# Altium project Unnamed_PCB.PrjPcb
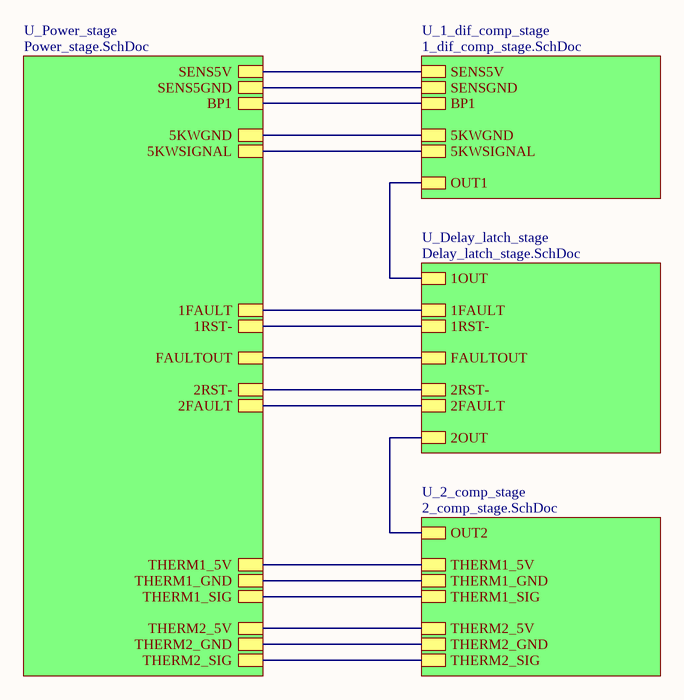
[diagram p0: Port_Connections.SchDoc]
5 sheets, 161 parts. Net scope: hierarchical (ports join the sheet entries above them; power ports are global).
Board file: PCB.PcbDoc
Sheets:
  Port_Connections.SchDoc
    U_2_comp_stage = 2_comp_stage.SchDoc
    U_Power_stage = Power_stage.SchDoc
    U_Delay_latch_stage = Delay_latch_stage.SchDoc
    U_1_dif_comp_stage = 1_dif_comp_stage.SchDoc

## Sheet Port_Connections.SchDoc
size A4; SheetNumber: 1; SheetTotal: 4

### Sub-sheets
U_1_dif_comp_stage = 1_dif_comp_stage.SchDoc: SENS5V, SENSGND, 5KWGND, BP1, 5KWSIGNAL, OUT1
U_2_comp_stage = 2_comp_stage.SchDoc: THERM2_5V, THERM2_GND, THERM2_SIG, THERM1_SIG, THERM1_GND, THERM1_5V, OUT2
U_Delay_latch_stage = Delay_latch_stage.SchDoc: FAULTOUT, 2FAULT, 1FAULT, 1OUT, 2OUT, 1RST-, 2RST-
U_Power_stage = Power_stage.SchDoc: SENS5V, SENS5GND, BP1, 5KWSIGNAL, 5KWGND, FAULTOUT, 1RST-, 1FAULT, 2FAULT, THERM1_5V, THERM1_GND, THERM1_SIG, THERM2_5V, THERM2_GND, THERM2_SIG, 2RST-

### Nets
1FAULT: sheet U_Power_stage/1FAULT, sheet U_Delay_latch_stage/1FAULT
1RST-: sheet U_Power_stage/1RST-, sheet U_Delay_latch_stage/1RST-
2FAULT: sheet U_Power_stage/2FAULT, sheet U_Delay_latch_stage/2FAULT
2RST-: sheet U_Power_stage/2RST-, sheet U_Delay_latch_stage/2RST-
5KWGND: sheet U_Power_stage/5KWGND, sheet U_1_dif_comp_stage/5KWGND
5KWSIGNAL: sheet U_Power_stage/5KWSIGNAL, sheet U_1_dif_comp_stage/5KWSIGNAL
BP1: sheet U_Power_stage/BP1, sheet U_1_dif_comp_stage/BP1
SENS5V: sheet U_Power_stage/SENS5V, sheet U_1_dif_comp_stage/SENS5V
SENSGND: sheet U_Power_stage/SENS5GND, sheet U_1_dif_comp_stage/SENSGND
THERM1_5V: sheet U_2_comp_stage/THERM1_5V, sheet U_Power_stage/THERM1_5V
THERM1_GND: sheet U_2_comp_stage/THERM1_GND, sheet U_Power_stage/THERM1_GND
THERM1_SIG: sheet U_2_comp_stage/THERM1_SIG, sheet U_Power_stage/THERM1_SIG
THERM2_5V: sheet U_2_comp_stage/THERM2_5V, sheet U_Power_stage/THERM2_5V
THERM2_GND: sheet U_2_comp_stage/THERM2_GND, sheet U_Power_stage/THERM2_GND
THERM2_SIG: sheet U_2_comp_stage/THERM2_SIG, sheet U_Power_stage/THERM2_SIG
NetD91_2: sheet U_Delay_latch_stage/1OUT, sheet U_1_dif_comp_stage/OUT1
NetD93_2: sheet U_2_comp_stage/OUT2, sheet U_Delay_latch_stage/2OUT
NetR112_2: sheet U_Power_stage/FAULTOUT, sheet U_Delay_latch_stage/FAULTOUT

## Sheet 2_comp_stage.SchDoc
size A4; SheetNumber: 3; SheetTotal: 6
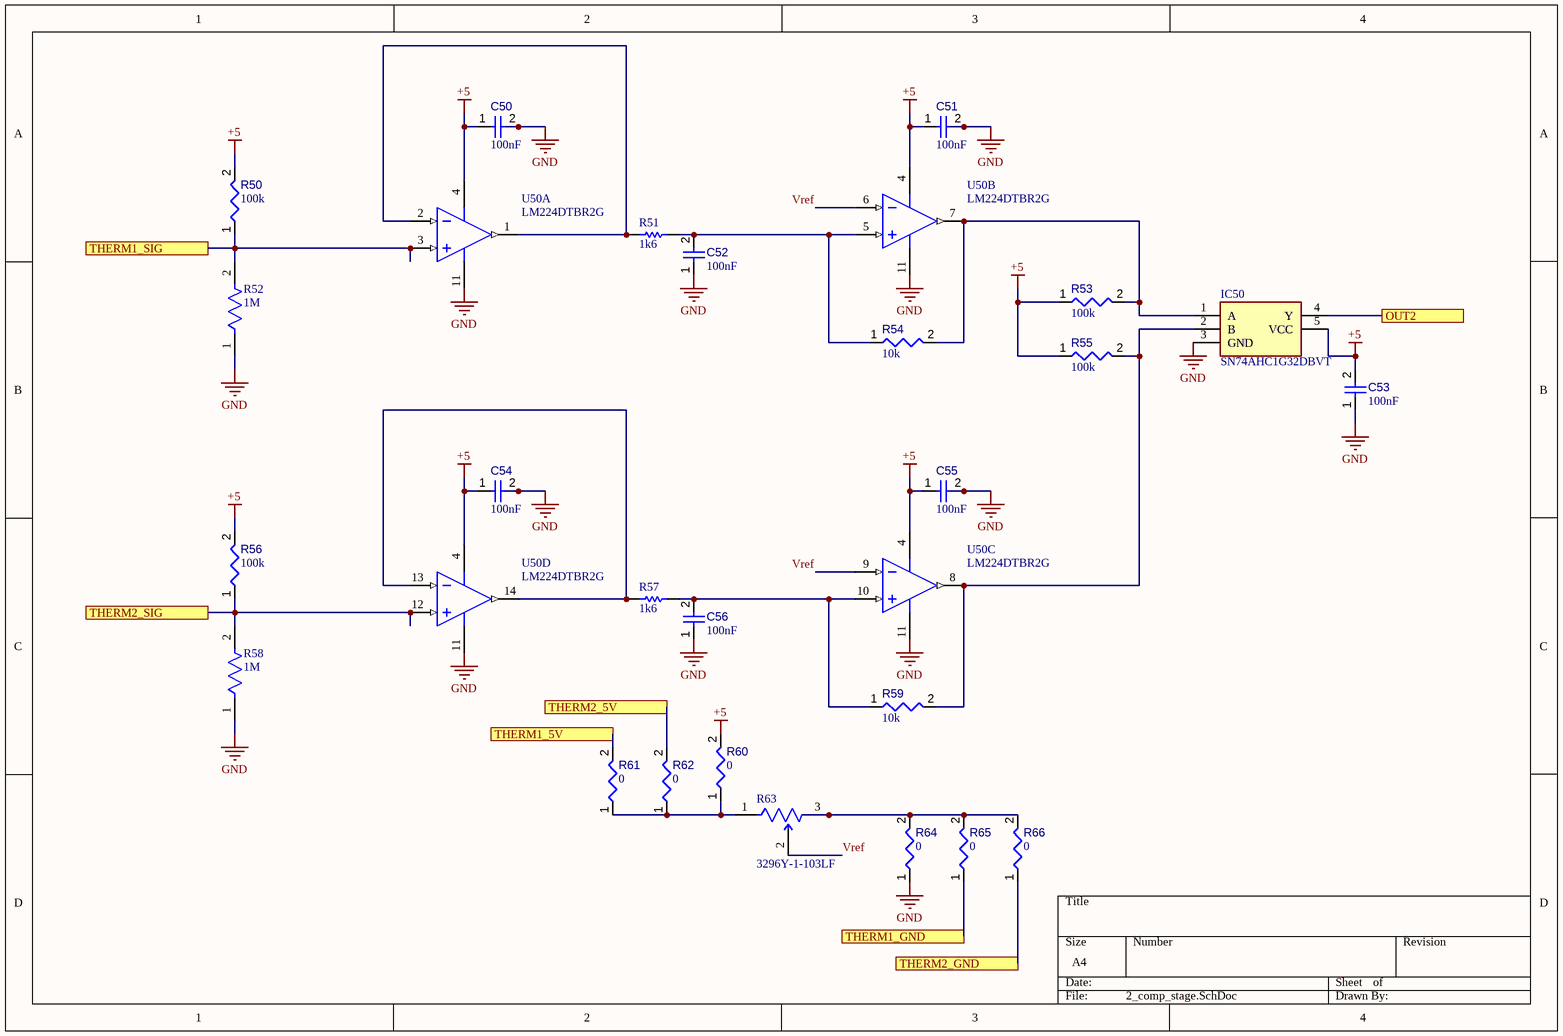
[diagram p1: 2_comp_stage.SchDoc]

### Parts
C50  value 100nF  [CAPC1608X90X40NL10T20]  (hidden comment: Capacitor 100 nF +/-10% 50 V 0603)
C51  value 100nF  [CAPC1608X90X40NL10T20]  (hidden comment: Capacitor 100 nF +/-10% 50 V 0603)
C52  value 100nF  [CAPC1608X90X40NL10T20]  (hidden comment: Capacitor 100 nF +/-10% 50 V 0603)
C53  value 100nF  [CAPC1608X90X40NL10T20]  (hidden comment: Capacitor 100 nF +/-10% 50 V 0603)
C54  value 100nF  [CAPC1608X90X40NL10T20]  (hidden comment: Capacitor 100 nF +/-10% 50 V 0603)
C55  value 100nF  [CAPC1608X90X40NL10T20]  (hidden comment: Capacitor 100 nF +/-10% 50 V 0603)
C56  value 100nF  [CAPC1608X90X40NL10T20]  (hidden comment: Capacitor 100 nF +/-10% 50 V 0603)
IC50  SN74AHC1G32DBVT  [SOT95P280X145-5N]
R50  value 100k  [RESC1608X55X25ML10T15]  (hidden comment: Resistor 100k +/-1% 0603 100 mW)
R51  1k6  [RESC1609X50X30LL10T20]
R52  1M  [FP-RMCF0603-IPC_B]
R53  value 100k  [RESC1608X55X25ML10T15]  (hidden comment: Resistor 100k +/-1% 0603 100 mW)
R54  value 10k  [RESC1608X55X25ML10T15]  (hidden comment: Resistor 10k +/-1% 0603 100 mW)
R55  value 100k  [RESC1608X55X25ML10T15]  (hidden comment: Resistor 100k +/-1% 0603 100 mW)
R56  value 100k  [RESC1608X55X25ML10T15]  (hidden comment: Resistor 100k +/-1% 0603 100 mW)
R57  1k6  [RESC1609X50X30LL10T20]
R58  1M  [FP-RMCF0603-IPC_B]
R59  value 10k  [RESC1608X55X25ML10T15]  (hidden comment: Resistor 10k +/-1% 0603 100 mW)
R60  value 0  [RESC0603(1608)_L]  (hidden comment: 0R3J)
R61  value 0  [RESC0603(1608)_L]  (hidden comment: 0R3J)
R62  value 0  [RESC0603(1608)_L]  (hidden comment: 0R3J)
R63  3296Y-1-103LF  [FP-3296Y-MFG]
R64  value 0  [RESC0603(1608)_L]  (hidden comment: 0R3J)
R65  value 0  [RESC0603(1608)_L]  (hidden comment: 0R3J)
R66  value 0  [RESC0603(1608)_L]  (hidden comment: 0R3J)
U50  LM224DTBR2G  [ONSC-TSSOP-14-948G-01_V]  (parts A,B,C,D of 4)

### Ports
OUT2, THERM1_5V, THERM1_GND, THERM1_SIG, THERM2_5V, THERM2_GND, THERM2_SIG

### Nets
+5: C50.1 C51.1 C53.2 C54.1 C55.1 IC50.5(VCC) R50.2 R53.1 R55.1 R56.2 R60.2 U50.4(VCC)
GND: C50.2 C51.2 C52.1 C53.1 C54.2 C55.2 C56.1 IC50.3(GND) R52.1 R58.1 R64.1 U50.11(VEE/GND)
THERM1_5V: R61.2 ; port THERM1_5V
THERM1_GND: R65.1 ; port THERM1_GND
THERM1_SIG: R50.1 R52.2 U50.3(IN1+) ; port THERM1_SIG
THERM2_5V: R62.2 ; port THERM2_5V
THERM2_GND: R66.1 ; port THERM2_GND
THERM2_SIG: R56.1 R58.2 U50.12(IN4+) ; port THERM2_SIG
Vref: R63.2(WIPER) U50.6(IN2-) U50.9(IN3-)
NetC52_2: C52.2 R51.2 R54.1 U50.5(IN2+)
NetC56_2: C56.2 R57.2 R59.1 U50.10(IN3+)
NetD93_2: IC50.4(Y) ; port OUT2
NetIC50_1: IC50.1(A) R53.2 R54.2 U50.7(OUT2)
NetIC50_2: IC50.2(B) R55.2 R59.2 U50.8(OUT3)
NetR51_1: R51.1 U50.1(OUT1) U50.2(IN1-)
NetR57_1: R57.1 U50.13(IN4-) U50.14(OUT4)
NetR60_1: R60.1 R61.1 R62.1 R63.1(CCW)
NetR63_3: R63.3(CW) R64.2 R65.2 R66.2

### Library data of the parts
C50-C56 = CMP-001-00017-6: Chip Capacitor, 100 nF, +/- 10%, 50 V, 0603 (1608 Metric); Voltage Rating: 50V; Capacitor Type: Ceramic; Tolerance: 10%; Mounting Technology: SM; Max Operating Temperature: 125°C; RoHS Compliant: True; Pins: 2; Case/Package: 0603; Min Operating Temperature: -55°C
IC50 = SN74AHC1G32DBVT: Integrated Circuit; Manufacturer_Name: Texas Instruments; Datasheet Link: http://www.ti.com/general/docs/lit/getliterature.tsp?genericPartNumber=sn74ahc1g32&fileType=pdf; Height: 1.45mm; Manufacturer_Part_Number: SN74AHC1G32DBVT; Mouser Part Number: 595-SN74AHC1G32DBVT; Mouser Price/Stock: https://www.mouser.co.uk/ProductDetail/Texas-Instruments/SN74AHC1G32DBVT?qs=fSCvMSq5ISVX4j%2FpWgAWfA%3D%3D; Arrow Part Number: SN74AHC1G32DBVT; Arrow Price/Stock: https://www.arrow.com/en/products/sn74ahc1g32dbvt/texas-instruments?region=nac
R50 R53 R55 R56 = CMP-009-00023-5: Chip Resistor, 100 KOhm, +/- 1%, 0.1 W, -55 to 155 degC, 0603 (1608 Metric); Voltage Rating: 50V; Power: 100mW; Max Operating Temperature: 155°C; RoHS Compliant: True; Tolerance: 1%; Pins: 2; Case/Package: 0603; Mounting Technology: SM; Min Operating Temperature: -55°C
R51 R57 = CMP-2000-03000-1: Part Number: CRCW06031K60FKEA; Manufacturer: Vishay Dale
R52 R58 = CMP-26527-006958-1: 1MΩ ±1% 0.1W 0603 Thick Film Chip Resistor AEC-Q200 compliant; Resistance: 1MR; Working Voltage: 75V; Temperature Coefficient: 100ppm/°C; Power Rating: 100mW; Series: RMCF; Case/Package: 0603; Packaging: Tape and Reel; Technology: THICK FILM; Depth: 0.8mm; Contact Plating: Tin; Lead Free: Lead Free; Mount: Surface Mount; Features: Automotive AEC-Q200; Construction: Rectangular; Length: 1.55mm; Tolerance: 1%; Resistor Type: Thick Film; Max Power Dissipation: 100mW; Case Code (Imperial): 0603; Height: 0.022inch; Max Operating Temperature: 155°C; Radiation Hardening: No; Width: 0.031inch; Min Operating Temperature: -55°C; Military Standard: Not; Number of Terminations: 2; Case Code (Metric): 1608; RoHS Compliant: Yes
R54 R59 = CMP-009-00017-5: Chip Resistor, 10 KOhm, +/- 1%, 01 W, -55 to 155 degC, 0603 (1608 Metric); Voltage Rating: 50V; Power: 100mW; RoHS Compliant: True; Min Operating Temperature: -55°C; Pins: 2; Case/Package: 0603; Mounting Technology: SM; Max Operating Temperature: 155°C; Tolerance: 1%
R60-R62 R64-R66 = CMP-009-00063-2: Jumper 0603 (1608 Metric); Case/Package: 0603; Mounting Technology: SMT; Pins: 2
R63 = CMP-07234-000015-2: TRIMMER 10K OHM 0.5W PC PIN TOP; Manufacturer Series: 3296; Resistance: 10kR; Actuator Orientation: Vertical; Power Rating: 500mW; Temperature Coefficient: 100ppm/°C; Resistance Tolerance: 10%; Resistance Law: Linear; Number of Turns: 25; Actuator Type: SCREW; Number of Terminals/Pins: 3; Insulation Resistance: 1GR; Military Standard: Not; REACH SVHC: No SVHC; Lead Free: Lead Free; Resistor Type: Cermet; Max Operating Temperature: 125°C; Radiation Hardening: No; Package Quantity: 50; Mount: Panel; Max Power Dissipation: 500mW; Min Operating Temperature: -55°C; Type: Potentiometer; Terminal Finish: Tin; Termination: Pin; Taper: Linear; Color: Blue; Technology: CERMET; Packaging: Rail/Tube; Weight: 0.03oz; Height: 0.395inch; Number of Pins: 3; RoHS Compliant: Yes; Width: 9.53mm; Tolerance: 10%; Depth: 4.83mm; Series: 3296; Length: 9.53mm
U50 = CMP-1310-00430-1: Single Supply Quad Operational Amplifier, 3 to 32 V, -25 to 85 degC, 14-Pin TSSOP, Pb-Free, Tape and Reel; Manufacturer: On Semiconductor; VCC Min (V): 3; VCC Max (V): 32; Mounting Technology: Surface Mount; PackageVersion: Rev. B, 10/2006; DatasheetVersion: Rev. 25; RoHS: TRUE; ComponentLink3URL: http://www.onsemi.com/pub_link/Collateral/948G-01.PDF; ComponentLink3Description: Package Specification; PackageDescription: 14-Pin Small Outline Package, Body 5 x 4.4 mm, Pitch 0.65 mm; PackageReference: TSSOP-14-948G-01; ComponentLink1URL: http://www.onsemi.com/; Packing: Tape and Reel; ComponentLink2Description: Datasheet; PartNumber: LM224DTBR2G; ComponentLink2URL: http://www.onsemi.cn/pub_link/Collateral/LM324-D.PDF; ComponentLink1Description: Manufacturer URL

## Sheet Power_stage.SchDoc
size A4; SheetNumber: 5; SheetTotal: 5
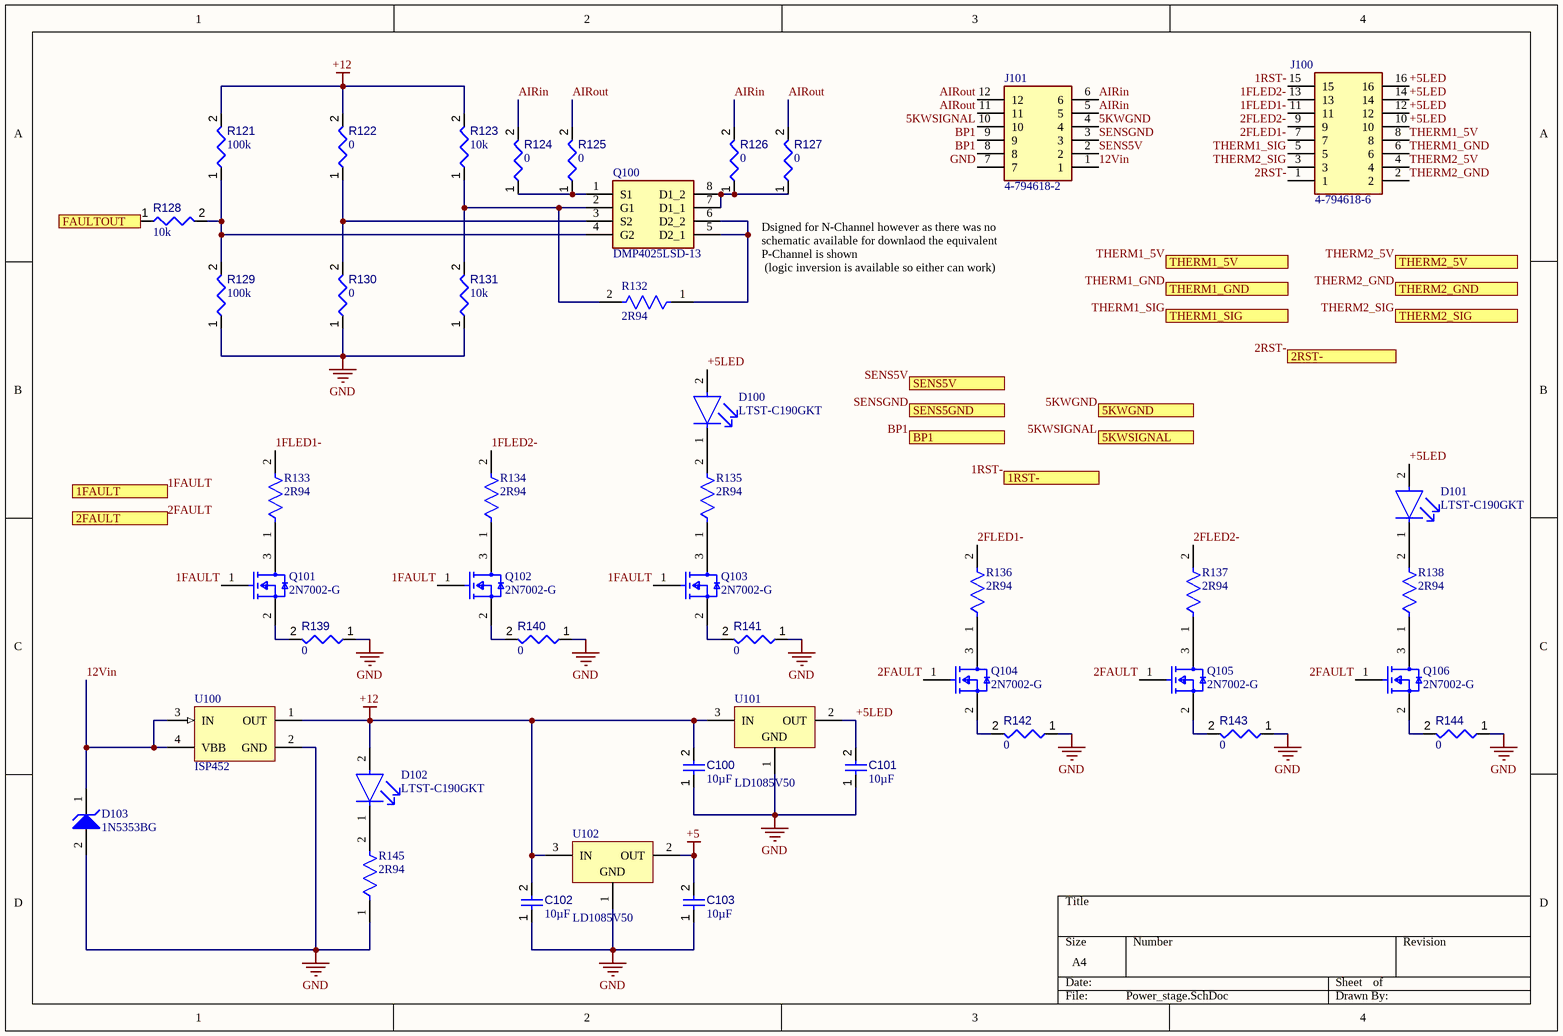
[diagram p2: Power_stage.SchDoc]

### Parts
C100  value 10µF  [CAPC0805(2012)145_L]  (hidden comment: Capacitor 10µF +/-20% 25V 0805)
C101  value 10µF  [CAPC0805(2012)145_L]  (hidden comment: Capacitor 10µF +/-20% 25V 0805)
C102  value 10µF  [CAPC0805(2012)145_L]  (hidden comment: Capacitor 10µF +/-20% 25V 0805)
C103  value 10µF  [CAPC0805(2012)145_L]  (hidden comment: Capacitor 10µF +/-20% 25V 0805)
D100  LTST-C190GKT  [FP-LTST-C190GKT-MFG]
D101  LTST-C190GKT  [FP-LTST-C190GKT-MFG]
D102  LTST-C190GKT  [FP-LTST-C190GKT-MFG]
D103  1N5353BG  [ONSC-SURMETIC40-2-017AA-01]
J100  4-794618-6  [47946186]
J101  4-794618-2  [47946182]
Q100  DMP4025LSD-13  [SOIC127P600X175-8N]
Q101  2N7002-G  [FP-2N7002-G-IPC_C]
Q102  2N7002-G  [FP-2N7002-G-IPC_C]
Q103  2N7002-G  [FP-2N7002-G-IPC_C]
Q104  2N7002-G  [FP-2N7002-G-IPC_C]
Q105  2N7002-G  [FP-2N7002-G-IPC_C]
Q106  2N7002-G  [FP-2N7002-G-IPC_C]
R121  value 100k  [RESC1608X55X25ML10T15]  (hidden comment: Resistor 100k +/-1% 0603 100 mW)
R122  value 0  [RESC0603(1608)_L]  (hidden comment: 0R3J)
R123  value 10k  [RESC1608X55X25ML10T15]  (hidden comment: Resistor 10k +/-1% 0603 100 mW)
R124  value 0  [RESC0603(1608)_L]  (hidden comment: 0R3J)
R125  value 0  [RESC0603(1608)_L]  (hidden comment: 0R3J)
R126  value 0  [RESC0603(1608)_L]  (hidden comment: 0R3J)
R127  value 0  [RESC0603(1608)_L]  (hidden comment: 0R3J)
R128  value 10k  [RESC1608X55X25ML10T15]  (hidden comment: Resistor 10k +/-1% 0603 100 mW)
R129  value 100k  [RESC1608X55X25ML10T15]  (hidden comment: Resistor 100k +/-1% 0603 100 mW)
R130  value 0  [RESC0603(1608)_L]  (hidden comment: 0R3J)
R131  value 10k  [RESC1608X55X25ML10T15]  (hidden comment: Resistor 10k +/-1% 0603 100 mW)
R132  2R94  [FP-CPF0603-MFG]
R133  2R94  [FP-CPF0603-MFG]
R134  2R94  [FP-CPF0603-MFG]
R135  2R94  [FP-CPF0603-MFG]
R136  2R94  [FP-CPF0603-MFG]
R137  2R94  [FP-CPF0603-MFG]
R138  2R94  [FP-CPF0603-MFG]
R139  value 0  [RESC0603(1608)_L]  (hidden comment: 0R3J)
R140  value 0  [RESC0603(1608)_L]  (hidden comment: 0R3J)
R141  value 0  [RESC0603(1608)_L]  (hidden comment: 0R3J)
R142  value 0  [RESC0603(1608)_L]  (hidden comment: 0R3J)
R143  value 0  [RESC0603(1608)_L]  (hidden comment: 0R3J)
R144  value 0  [RESC0603(1608)_L]  (hidden comment: 0R3J)
R145  2R94  [FP-CPF0603-MFG]
U100  ISP452  [INF-SOT223_L]
U101  LD1085V50  [TO220]
U102  LD1085V50  [TO220]

### Ports
1FAULT, 1RST-, 2FAULT, 2RST-, 5KWGND, 5KWSIGNAL, BP1, FAULTOUT, SENS5GND, SENS5V, THERM1_5V, THERM1_GND, THERM1_SIG, THERM2_5V, THERM2_GND, THERM2_SIG

### Nets
+5: C103.2 U102.2(OUT)
+12: C100.2 C102.2 D102.2(A) R121.2 R122.2 R123.2 U100.1(OUT) U101.3(IN) U102.3(IN)
GND: C100.1 C101.1 C102.1 C103.1 D103.2(A) J101.7 R129.1 R130.1 R131.1 R139.1 R140.1 R141.1 R142.1 R143.1 R144.1 R145.1 U100.2(GND) U101.1(GND) U102.1(GND)
1FAULT: Q101.1(GATE) Q102.1(GATE) Q103.1(GATE) ; port 1FAULT
1FLED1-: J100.11 R133.2
1FLED2-: J100.13 R134.2
1RST-: J100.15 ; port 1RST-
2FAULT: Q104.1(GATE) Q105.1(GATE) Q106.1(GATE) ; port 2FAULT
2FLED1-: J100.7 R136.2
2FLED2-: J100.9 R137.2
2RST-: J100.1 ; port 2RST-
5KWGND: J101.4 ; port 5KWGND
5KWSIGNAL: J101.10 ; port 5KWSIGNAL
12Vin: D103.1(K) J101.1 U100.3(IN) U100.4(VBB)
+5LED: C101.2 D100.2(A) D101.2(A) J100.10 J100.12 J100.14 J100.16 U101.2(OUT)
AIRin: J101.5 J101.6 R124.2 R126.2
AIRout: J101.11 J101.12 R125.2 R127.2
BP1: J101.8 J101.9 ; port BP1
SENS5V: J101.2 ; port SENS5V
SENSGND: J101.3 ; port SENS5GND
THERM1_5V: J100.8 ; port THERM1_5V
THERM1_GND: J100.6 ; port THERM1_GND
THERM1_SIG: J100.5 ; port THERM1_SIG
THERM2_5V: J100.4 ; port THERM2_5V
THERM2_GND: J100.2 ; port THERM2_GND
THERM2_SIG: J100.3 ; port THERM2_SIG
NetD100_1: D100.1(C) R135.2
NetD101_1: D101.1(C) R138.2
NetD102_1: D102.1(C) R145.2
NetQ100_1: Q100.1(S1) R124.1 R125.1
NetQ100_2: Q100.2(G1) R123.1 R131.2 R132.2
NetQ100_3: Q100.3(S2) R122.1 R130.2
NetQ100_4: Q100.4(G2) R121.1 R128.2 R129.2
NetQ100_5: Q100.5(D2_1) Q100.6(D2_2) R132.1
NetQ100_7: Q100.7(D1_1) Q100.8(D1_2) R126.1 R127.1
NetQ101_2: Q101.2(SOURCE) R139.2
NetQ101_3: Q101.3(DRAIN) R133.1
NetQ102_2: Q102.2(SOURCE) R140.2
NetQ102_3: Q102.3(DRAIN) R134.1
NetQ103_2: Q103.2(SOURCE) R141.2
NetQ103_3: Q103.3(DRAIN) R135.1
NetQ104_2: Q104.2(SOURCE) R142.2
NetQ104_3: Q104.3(DRAIN) R136.1
NetQ105_2: Q105.2(SOURCE) R143.2
NetQ105_3: Q105.3(DRAIN) R137.1
NetQ106_2: Q106.2(SOURCE) R144.2
NetQ106_3: Q106.3(DRAIN) R138.1
NetR112_2: R128.1 ; port FAULTOUT

### Notes on the sheet
- Dsigned for N-Channel however as there was no schematic available for downlaod the equivalent P-Channel is shown
  (logic inversion is available so either can work)

### Library data of the parts
C100-C103 = CMP-001-00079-4: Chip Capacitor, 10µF +/-20%, 25V, 0805, Thickness 1.45 mm; Tolerance: 10%; Max Operating Temperature: 85°C; Case/Package: 0805; Voltage Rating: 25V; Min Operating Temperature: -55°C; Mounting Technology: SMT; Pins: 2
D100-D102 = CMP-22017-000005-2: LED GREEN CLEAR CHIP SMD; Dominant Wavelength: 569nm; Reverse Voltage: 5V; Lens Color: Colorless; Viewing Angle: 130°; Voltage: 2V; Forward Current: 30mA; Power Dissipation: 100mW; Luminous Intensity: 6mcd; Number of LEDs: 1; Forward Voltage: 2.1V; Wavelength: 565nm; Test Current: 10mA; Min Operating Temperature: -55°C; Lens Style: Clear; Mount: Surface Mount; Width: 0.8mm; Packaging: Tape and Reel; Lens Transparency: Clear; Case Code (Metric): 1608; Depth: 0.8mm; Case Code (Imperial): 0603; Case/Package: 0603; Number of Pins: 2; Max Operating Temperature: 85°C; Lead Free: Lead Free; Number of Elements: 1; Length: 1.6mm; Height: 0.8mm; Package Quantity: 1; Power Rating: 100mW; Radiation Hardening: No; Illumination Color: Green; Color: Green
D103 = CMP-1060-01290-1: 5 W Zener Voltage Regulator, 2-Pin Surmetic(TM) 40, Pb-Free, Bulk Box; Manufacturer: On Semiconductor; P Max (W): 5; VZ Typ (V): 16; Packing: Bulk Box; RoHS: Pb-Free; DatasheetVersion: Rev. 14; PackageDescription: 2-Pin, Axial Lead, Diameter 3.49 mm; ComponentLink3Description: Package Specification; PackageVersion: Rev. O, 09/2005; Mounting Technology: Through Hole; ComponentLink2Description: Datasheet; PartNumber: 1N5353BG; PackageReference: SURMETIC40-2-017AA-01; ComponentLink2URL: http://www.onsemi.cn/pub_link/Collateral/1N5333B-D.PDF; ComponentLink3URL: http://www.onsemi.cn/pub_link/Collateral/017AA.PDF; ComponentLink1Description: Manufacturer URL; ComponentLink1URL: http://www.onsemi.com/
J100 = 4-794618-6: Connector; Manufacturer_Name: TE Connectivity; Datasheet Link: https://www.te.com/commerce/DocumentDelivery/DDEController?Action=showdoc&DocId=Customer+Drawing%7F794618%7FF4%7Fpdf%7FEnglish%7FENG_CD_794618_F4.pdf%7F4-794618-6; Height: 8.8mm; Manufacturer_Part_Number: 4-794618-6; Mouser Part Number: 571-4-794618-6; Mouser Price/Stock: https://www.mouser.co.uk/ProductDetail/TE-Connectivity-AMP/4-794618-6?qs=aUp63snYJwBR7PjA8Kx36Q%3D%3D
J101 = 4-794618-2: Connector; Manufacturer_Name: TE Connectivity; Datasheet Link: https://componentsearchengine.com/Datasheets/2/4-794618-2.pdf; Height: 8.67mm; Manufacturer_Part_Number: 4-794618-2; Mouser Part Number: 571-4-794618-2; Mouser Price/Stock: https://www.mouser.co.uk/ProductDetail/TE-Connectivity-AMP/4-794618-2?qs=So72BguRTJaXDhFpFUBejg%3D%3D; Arrow Part Number: 4-794618-2; Arrow Price/Stock: https://www.arrow.com/en/products/4-794618-2/te-connectivity
Q100 = DMP4025LSD-13: MOSFET (P-Channel); Manufacturer_Name: Diodes Inc.; Datasheet Link: https://ms.componentsearchengine.com/Datasheets/2/DMP4025LSD-13.pdf; Height: 1.75mm; Manufacturer_Part_Number: DMP4025LSD-13; Mouser Part Number: 621-DMP4025LSD-13; Mouser Price/Stock: https://www.mouser.co.uk/ProductDetail/Diodes-Incorporated/DMP4025LSD-13?qs=gfe7vQ8txpWs%252BZpALpt3%252Bg%3D%3D; Arrow Part Number: DMP4025LSD-13; Arrow Price/Stock: https://www.arrow.com/en/products/dmp4025lsd-13/diodes-incorporated
Q101-Q106 = CMP-06369-000003-1: MOSFET N-CH 60V 0.115A SOT23-3; Manufacturer: Microchip; Standoff Height: 0.01mm; Rthja Max: 203°C/W; Continuous Drain Current: 115mA; Depletion Mode: False; Typ Forward Diode Voltage: 1.2V; Number Of Channels: 1; Power Dissipation: 0.36W; Turn Off Delay Time: 20ns; Threshold Vgs Min: 1V; Threshold Vgs Max: 2.5V; Drain To Source Resistance: 7.5Ω; Input Capacitace At Vds: 50pF @ 25V; Reverse Recovery Time: 400ns; Pulse Drain Current: 800mA; Gate To Source Voltage: 30V; Manufacturer Part Number: 2N7002-G; Ambient Temperature Range Low: -55°C; Temperature Range Low: -55°C; ComponentLink2Description: Datasheet; Automotive: No; Temperature Range High: +150°C; Temperature: -55°C to +150°C; Ambient Temperature Range High: +150°C; ComponentLink2URL: http://ww1.microchip.com/downloads/en/DeviceDoc/2N7002-N-Channel-Enhancement-Mode-Vertical-DMOS-FET-Data-Sheet-20005797A.pdf; Octopart: https://octopart.com/2n7002-g-microchip-47153309; Mouser Description: Mosfet; N-channel Enhancement Mode; 60V; 7.5 OHM3 SOT-23T/R; Lead Free: Yes; Number Of N Channels: 1; Turn On Delay Time: 20ns; RoHS: TRUE; Digikey Description: MOSFET N-CH 60V 0.115A SOT23-3; Category: Trans; Ipc Land Pattern Name: SOT95P237X100-3; Height: 1.12mm; Device Class L2: Transistors; Drain To Source Breakdown Voltage: 60V; Device Class L1: Discrete Semiconductors; Drain To Source Voltage: 60V; Device Class L3: MOSFETs; Package: 2N7002-G
R121 R129 = CMP-009-00023-5: as R50 on sheet 2_comp_stage; Max Operating Temperature: 155°C; RoHS Compliant: True; Tolerance: 1%; Pins: 2; Case/Package: 0603; Mounting Technology: SM; Min Operating Temperature: -55°C
R122 R124-R127 R130 R139-R144 = CMP-009-00063-2: Jumper 0603 (1608 Metric); Case/Package: 0603; Mounting Technology: SMT; Pins: 2
R123 R128 R131 = CMP-009-00017-5: as R54 on sheet 2_comp_stage; RoHS Compliant: True; Min Operating Temperature: -55°C; Pins: 2; Case/Package: 0603; Mounting Technology: SM; Max Operating Temperature: 155°C; Tolerance: 1%
R132-R138 R145 = CMP-03211-006952-1: RES SMD 2.94Ω 1% 1/16W 0603; Manufacturer Part Number: CPF0603F2R94C1; Manufacturer: TE Connectivity; Power Rating: 0.063W; Voltage Rating: 50V; Temperature Coefficient: 50ppm/°C; ComponentLink2URL: https://www.te.com/commerce/DocumentDelivery/DDEController?Action=showdoc&DocId=Data+Sheet%7F1773200%7FM%7Fpdf%7FEnglish%7FENG_DS_1773200_M.pdf%7F3-1676481-2; Ipc Land Pattern Name: RESC15580X45; ComponentLink2Description: Datasheet; Package: CPF0603; Automotive: No; Value: 2.94Ω; Temperature Range Low: -55°C; RoHS: TRUE; Resistance: 2.94Ω; Height: 0.55mm; Lead Free: Yes; Device Class L3: Chip SMD Resistors; Series: CPF; octopart_url: https://octopart.com/cpf0603f2r94c1-te+connectivity-7515214; Tolerance: 1%; Composition: Thin Film; Temperature Range High: +155°C; Device Class L1: Passive Components; Octopart: https://octopart.com/cpf0603f2r94c1-te+connectivity-7515214; Temperature: -55°C to +155°C; Category: Res; Device Class L2: Resistors; packaging: 1k Reel
U100 = CMP-1095-00141-1: Smart Power High-Side-Switch for Industrial Applications, 5 to 34 V Operating, -30 to 85 degC, SOT223, Reel, Green; Manufacturer: Infineon; Green: TRUE; IL (nom)min - all channels active: 0.7Â A; Channels: 1; IL (nom)min - one channel active: 0.8Â A; Operating Voltage Range (min): 5 V; Ptot (max): 1.8Â W; toff (max): 150 us; RON (max) @ Tj max: 400 mOhm; ton (max): 100 us; IL (SCp): 1.5Â A; Operating Voltage Range (max): 34 V; RON @ 25 degC: 200 mOhm (max); ComponentLink3Description: Package Specification; Mounting Technology: Surface Mount; ComponentLink2Description: Datasheet; PartNumber: ISP452; Packing: Reel; Load Current (typ): 0.7Â A; PackageDescription: 4-Pin Small Outline Transistor Package, 6.5 x 3.5 mm Body, 2.3 mm Pitch; ComponentLink3URL: http://www.infineon.com/dgdl/SOT223-Package_Overview.pdf?folderId=db3a30431936bc4b0119530470b03c3d&fileId=db3a30431936bc4b0119531d40b93c5c; ComponentLink1Description: Manufacturer URL; ComponentLink1URL: http://www.infineon.com/; ComponentLink2URL: http://www.infineon.com/dgdl/ISP452_20060301.pdf?folderId=db3a304412b407950112b408e8c90004&fileId=db3a304412b407950112b42957ef40c3; PackageReference: SOT223; IL (SC): 1.5Â A; PackageVersion: Apr-08
U101 U102 = CMP-0244-00494-1: 3A, Low Drop Positive Voltage Regulator, 5V, 3-Pin TO-220; ComponentLink1URL: http://www.st.com; PackageDescription: TO, Thru-Hole, Vertical, Heatsink Mounted; 3 In-Line Leads; Pitch 2.54 mm; DatasheetVersion: 28/07/2009; PackageVersion: ver3.0; ComponentLink2URL: http://www.st.com/internet/com/TECHNICAL_RESOURCES/TECHNICAL_LITERATURE/DATASHEET/CD00001883.pdf; ComponentLink1Description: Manufacturer URL; PackageReference: TO220; ComponentLink2Description: Datasheet; ComponentLink3URL: http://www.st.com/internet/com/TECHNICAL_RESOURCES/TECHNICAL_LITERATURE/PACKAGE_INFORMATION/CD00004649.pdf; ComponentLink3Description: Package Specification

## Sheet Delay_latch_stage.SchDoc
size A4; SheetNumber: 4; SheetTotal: 5
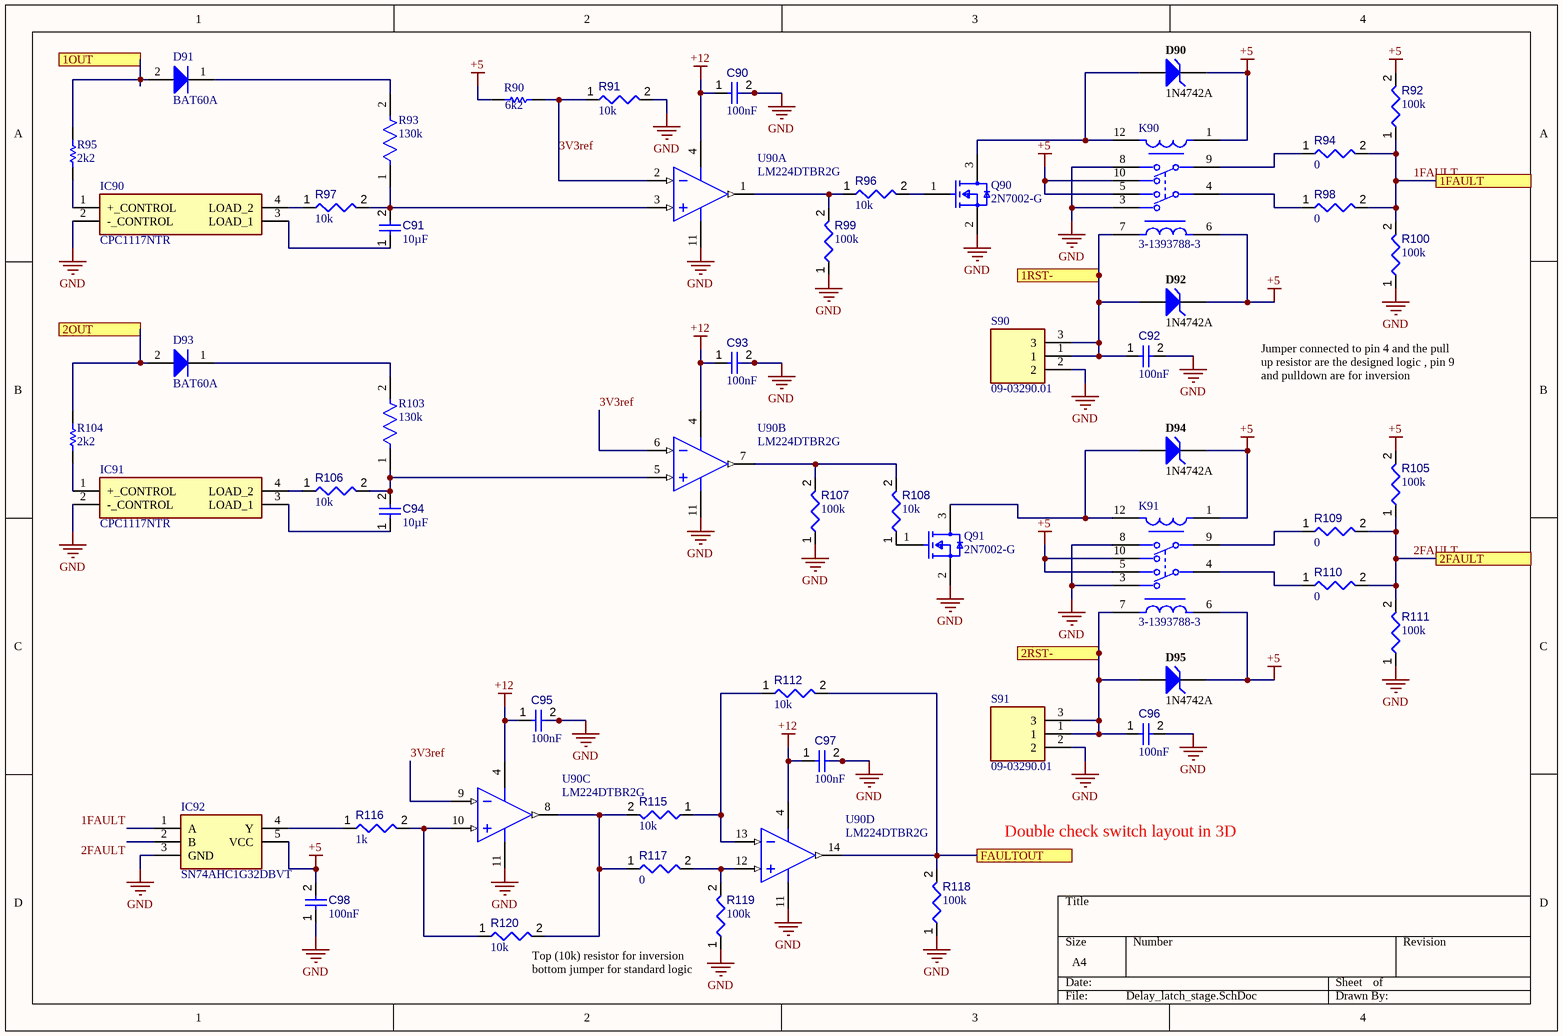
[diagram p3: Delay_latch_stage.SchDoc]

### Parts
C90  value 100nF  [CAPC1608X90X40NL10T20]  (hidden comment: Capacitor 100 nF +/-10% 50 V 0603)
C91  value 10µF  [CAPC0603(1608)100_L]  (hidden comment: Capacitor 10µF +/-20% 10V 0603)
C92  value 100nF  [CAPC1608X90X40NL10T20]  (hidden comment: Capacitor 100 nF +/-10% 50 V 0603)
C93  value 100nF  [CAPC1608X90X40NL10T20]  (hidden comment: Capacitor 100 nF +/-10% 50 V 0603)
C94  value 10µF  [CAPC0603(1608)100_L]  (hidden comment: Capacitor 10µF +/-20% 10V 0603)
C95  value 100nF  [CAPC1608X90X40NL10T20]  (hidden comment: Capacitor 100 nF +/-10% 50 V 0603)
C96  value 100nF  [CAPC1608X90X40NL10T20]  (hidden comment: Capacitor 100 nF +/-10% 50 V 0603)
C97  value 100nF  [CAPC1608X90X40NL10T20]  (hidden comment: Capacitor 100 nF +/-10% 50 V 0603)
C98  value 100nF  [CAPC1608X90X40NL10T20]  (hidden comment: Capacitor 100 nF +/-10% 50 V 0603)
D90  1N4742A  [FAIR-DO-41-2_V]
D91  BAT60A  [INF-SOD323_V]
D92  1N4742A  [FAIR-DO-41-2_V]
D93  BAT60A  [INF-SOD323_V]
D94  1N4742A  [FAIR-DO-41-2_V]
D95  1N4742A  [FAIR-DO-41-2_V]
IC90  CPC1117NTR  [SOP254P610X216-4N]
IC91  CPC1117NTR  [SOP254P610X216-4N]
IC92  SN74AHC1G32DBVT  [SOT95P280X145-5N]
K90  3-1393788-3  [FP-3-1393788-3-MFG]
K91  3-1393788-3  [FP-3-1393788-3-MFG]
Q90  2N7002-G  [FP-2N7002-G-IPC_C]
Q91  2N7002-G  [FP-2N7002-G-IPC_C]
R90  6k2  [RESC1609X50X30ML10T20]
R91  value 10k  [RESC1608X55X25ML10T15]  (hidden comment: Resistor 10k +/-1% 0603 100 mW)
R92  value 100k  [RESC1608X55X25ML10T15]  (hidden comment: Resistor 100k +/-1% 0603 100 mW)
R93  130k  [FP-CRCW0603-e3-IPC_C]
R94  value 0  [RESC0603(1608)_L]  (hidden comment: 0R3J)
R95  2k2  [RESC1608X55X25LL10T15]
R96  value 10k  [RESC1608X55X25ML10T15]  (hidden comment: Resistor 10k +/-1% 0603 100 mW)
R97  value 10k  [RESC1608X55X25ML10T15]  (hidden comment: Resistor 10k +/-1% 0603 100 mW)
R98  value 0  [RESC0603(1608)_L]  (hidden comment: 0R3J)
R99  value 100k  [RESC1608X55X25ML10T15]  (hidden comment: Resistor 100k +/-1% 0603 100 mW)
R100  value 100k  [RESC1608X55X25ML10T15]  (hidden comment: Resistor 100k +/-1% 0603 100 mW)
R103  130k  [FP-CRCW0603-e3-IPC_C]
R104  2k2  [RESC1608X55X25LL10T15]
R105  value 100k  [RESC1608X55X25ML10T15]  (hidden comment: Resistor 100k +/-1% 0603 100 mW)
R106  value 10k  [RESC1608X55X25ML10T15]  (hidden comment: Resistor 10k +/-1% 0603 100 mW)
R107  value 100k  [RESC1608X55X25ML10T15]  (hidden comment: Resistor 100k +/-1% 0603 100 mW)
R108  value 10k  [RESC1608X55X25ML10T15]  (hidden comment: Resistor 10k +/-1% 0603 100 mW)
R109  value 0  [RESC0603(1608)_L]  (hidden comment: 0R3J)
R110  value 0  [RESC0603(1608)_L]  (hidden comment: 0R3J)
R111  value 100k  [RESC1608X55X25ML10T15]  (hidden comment: Resistor 100k +/-1% 0603 100 mW)
R112  value 10k  [RESC1608X55X25ML10T15]  (hidden comment: Resistor 10k +/-1% 0603 100 mW)
R115  value 10k  [RESC1608X55X25ML10T15]  (hidden comment: Resistor 10k +/-1% 0603 100 mW)
R116  value 1k  [RESC1608X55X25ML10T15]  (hidden comment: Resistor 1k +/-1% 0603 100 mW)
R117  value 0  [RESC0603(1608)_L]  (hidden comment: 0R3J)
R118  value 100k  [RESC1608X55X25ML10T15]  (hidden comment: Resistor 100k +/-1% 0603 100 mW)
R119  value 100k  [RESC1608X55X25ML10T15]  (hidden comment: Resistor 100k +/-1% 0603 100 mW)
R120  value 10k  [RESC1608X55X25ML10T15]  (hidden comment: Resistor 10k +/-1% 0603 100 mW)
S90  09-03290.01  [09.03290.01]
S91  09-03290.01  [09.03290.01]
U90  LM224DTBR2G  [ONSC-TSSOP-14-948G-01_V]  (parts A,B,C,D of 4)

### Ports
1FAULT, 1OUT, 1RST-, 2FAULT, 2OUT, 2RST-, FAULTOUT

### Nets
+5: C98.2 D90.2(K) D92.2(K) D94.2(K) D95.2(K) IC92.5(VCC) K90.1(set+/reset-) K90.5 K90.6(reset+/set-) K90.10 K91.1(set+/reset-) K91.5 K91.6(reset+/set-) K91.10 R90.1 R92.2 R105.2
+12: C90.1 C93.1 C95.1 C97.1 U90.4(VCC)
GND: C90.2 C92.2 C93.2 C95.2 C96.2 C97.2 C98.1 IC90.2(-_CONTROL) IC91.2(-_CONTROL) IC92.3(GND) K90.3 K90.8 K91.3 K91.8 Q90.2(SOURCE) Q91.2(SOURCE) R91.2 R99.1 R100.1 R107.1 R111.1 R118.1 R119.1 S90.2 S91.2 U90.11(VEE/GND)
1FAULT: IC92.1(A) R92.1 R94.2 R98.2 R100.2 ; port 1FAULT
1RST-: C92.1 D92.1(A) K90.7(reset-/set+) S90.1 S90.3 ; port 1RST-
2FAULT: IC92.2(B) R105.1 R109.2 R110.2 R111.2 ; port 2FAULT
2RST-: C96.1 D95.1(A) K91.7(reset-/set+) S91.1 S91.3 ; port 2RST-
3V3ref: R90.2 R91.1 U90.2(IN1-) U90.6(IN2-) U90.9(IN3-)
NetC91_1: C91.1 IC90.3(LOAD_1)
NetC91_2: C91.2 R93.1 R97.2 U90.3(IN1+)
NetC94_1: C94.1 IC91.3(LOAD_1)
NetC94_2: C94.2 R103.1 R106.2 U90.5(IN2+)
NetD90_1: D90.1(A) K90.12(set-/reset+) Q90.3(DRAIN)
NetD91_1: D91.1(K) R93.2
NetD91_2: D91.2(A) R95.2 ; port 1OUT
NetD93_1: D93.1(K) R103.2
NetD93_2: D93.2(A) R104.2 ; port 2OUT
NetD94_1: D94.1(A) K91.12(set-/reset+) Q91.3(DRAIN)
NetIC90_1: IC90.1(+_CONTROL) R95.1
NetIC90_4: IC90.4(LOAD_2) R97.1
NetIC91_1: IC91.1(+_CONTROL) R104.1
NetIC91_4: IC91.4(LOAD_2) R106.1
NetIC92_4: IC92.4(Y) R116.1
NetK90_4: K90.4 R98.1
NetK90_9: K90.9 R94.1
NetK91_4: K91.4 R110.1
NetK91_9: K91.9 R109.1
NetQ90_1: Q90.1(GATE) R96.2
NetQ91_1: Q91.1(GATE) R108.1
NetR96_1: R96.1 R99.2 U90.1(OUT1)
NetR107_2: R107.2 R108.2 U90.7(OUT2)
NetR112_1: R112.1 R115.1 U90.13(IN4-)
NetR112_2: R112.2 R118.2 U90.14(OUT4) ; port FAULTOUT
NetR115_2: R115.2 R117.1 R120.2 U90.8(OUT3)
NetR116_2: R116.2 R120.1 U90.10(IN3+)
NetR117_2: R117.2 R119.2 U90.12(IN4+)

### Notes on the sheet
- Jumper connected to pin 4 and the pull up resistor are the designed logic , pin 9 and pulldown are for inversion
- Double check switch layout in 3D
- (near R120) Top (10k) resistor for inversion bottom jumper for standard logic

### Library data of the parts
C90 C92 C93 C95-C98 = CMP-001-00017-6: as C50 on sheet 2_comp_stage; Tolerance: 10%; Mounting Technology: SM; Max Operating Temperature: 125°C; RoHS Compliant: True; Pins: 2; Case/Package: 0603; Min Operating Temperature: -55°C
C91 C94 = CMP-001-00075-4: Chip Capacitor, 10µF +/-20%, 10V, 0603, Thickness 1 mm; Tolerance: 10%; Voltage Rating: 10V; Max Operating Temperature: 85°C; Pins: 2; Case/Package: 0603; Mounting Technology: SMT; Min Operating Temperature: -55°C
D90 D92 D94 D95 = CMP-0892-00001-1: Zener Diode, 12V, 1W, 5%, -65 to 200 degC, 2-Pin DO-41, Body 2.72 x 5.2 mm, RoHS; Manufacturer: Fairchild Semiconductor; PD (W): 1; VZ (Min.) (V): 11.4; VZ (Max.) (V): 12.6; ZZ (Max) (ohm): 8; IR (uA): 5; Test Current IZ (mA): 21; PartNumber: 1N4742A; PackageVersion: Rev. 2; DatasheetVersion: Rev. H3; Mounting Technology: Through Hole; Tolerance: 5%; PackageDescription: 2-Pin Axial leaded, Body 2.72 x 5.2 mm, Lead Spread 25.4 mm; ComponentLink1Description: Manufacturer URL; ComponentLink3Description: Package Specification; ComponentLink2Description: Datasheet; ComponentLink2URL: http://www.fairchildsemi.com/ds/1N/1N4744A.pdf; PackageReference: DO-41-2; RoHS: TRUE; Operating and Storage Temperature Range: -65 to 200 degC; ComponentLink3URL: http://www.fairchildsemi.com/dwg/DO/DO41A.pdf; ComponentLink1URL: http://www.fairchildsemi.com/
D91 D93 = CMP-1183-00008-2: Silicon Schottky Diode, -55 to 85 degC, SOD323, Reel, Green; Manufacturer: Infineon; Green: TRUE; VR (max): 10Â V; IF (max): 3,000Â mA; VF (max): 370Â mV; CT (max): 35Â pF; Configuration: Single; PackageDescription: 3-Pin Small Outline Transistor Package, 1.25 x 2 mm Body, 0.65 mm Pitch; PartNumber: BAT60A; Mounting Technology: Surface Mount; PackageReference: SOT323; ComponentLink1Description: Manufacturer URL; Packing: Reel; ComponentLink3URL: http://www.infineon.com/dgdl/SOT323-Package_Overview.pdf?folderId=db3a30431936bc4b0119533e1dcb3c92&fileId=db3a30431936bc4b011953495f283cb1; ComponentLink2URL: http://www.infineon.com/dgdl/bat60aseries.pdf?folderId=db3a304313d846880113def5812204a1&fileId=db3a304313d846880113def70c9304a9; ComponentLink1URL: http://www.infineon.com/; ComponentLink2Description: Datasheet; ComponentLink3Description: Package Specification
IC90 IC91 = CPC1117NTR: Integrated Circuit; Manufacturer_Name: LITTELFUSE; Datasheet Link: https://componentsearchengine.com//CPC1117NTR.pdf; Height: 2.159mm; Mouser2 Part Number: 849-CPC1117NTR; Mouser2 Price/Stock: https://www.mouser.com/Search/Refine.aspx?Keyword=849-CPC1117NTR; Manufacturer_Part_Number: CPC1117NTR
IC92 = SN74AHC1G32DBVT: as IC50 on sheet 2_comp_stage; Datasheet Link: http://www.ti.com/general/docs/lit/getliterature.tsp?genericPartNumber=sn74ahc1g32&fileType=pdf; Height: 1.45mm; Manufacturer_Part_Number: SN74AHC1G32DBVT; Mouser Part Number: 595-SN74AHC1G32DBVT; Mouser Price/Stock: https://www.mouser.co.uk/ProductDetail/Texas-Instruments/SN74AHC1G32DBVT?qs=fSCvMSq5ISVX4j%2FpWgAWfA%3D%3D; Arrow Part Number: SN74AHC1G32DBVT; Arrow Price/Stock: https://www.arrow.com/en/products/sn74ahc1g32dbvt/texas-instruments?region=nac
K90 K91 = CMP-03396-000001-1: RELAY GEN PURPOSE DPDT 2A 5VDC; Manufacturer: TE Connectivity; Switching Power: 60W; Coil Voltage: 5V; Coil Resistance: 178Ω; Switching Current: 5A; Coil Power: 140mW; Standoff Height: 0.4mm; Coil Type: Latching and Dual Coil; Number Of Contacts: 2; Mouser Description: Electromechanical Relay 5VDC 178Ohm 2A DPDT (14.5x7.2x9.8)mm THT Signal Relay; Package: 3-1393788-3; ComponentLink2URL: https://www.te.com/usa-en/product-3-1393788-3.html?te_bu=Cor&te_type=other&te_campaign=oct_glo_cor-oct-global-oth-prtnr-fy19-oct-octo-buy-bom_sma-298_2&elqCampaignId=35216; Height: 9.9mm; Lead Free: Yes; Ambient Temperature Range Low: -40°C; Octopart: https://octopart.com/3-1393788-3-te+connectivity-40665546; Manufacturer Part Number: 3-1393788-3; Throw Configuration: DPDT; Category: Relay; ComponentLink2Description: Datasheet; Ambient Temperature Range High: +85°C; Device Class L1: Electromechanical; Automotive: No; Current Rating: 2A; Digikey Description: RELAY GEN PURPOSE DPDT 2A 5VDC; RoHS: TRUE; Device Class L2: Relays; Device Class L3: Signal Relays
Q90 Q91 = CMP-06369-000003-1: as Q101 on sheet Power_stage; Manufacturer Part Number: 2N7002-G; Ambient Temperature Range Low: -55°C; Temperature Range Low: -55°C; ComponentLink2Description: Datasheet; Automotive: No; Temperature Range High: +150°C; Temperature: -55°C to +150°C; Ambient Temperature Range High: +150°C; ComponentLink2URL: http://ww1.microchip.com/downloads/en/DeviceDoc/2N7002-N-Channel-Enhancement-Mode-Vertical-DMOS-FET-Data-Sheet-20005797A.pdf; Octopart: https://octopart.com/2n7002-g-microchip-47153309; Mouser Description: Mosfet; N-channel Enhancement Mode; 60V; 7.5 OHM3 SOT-23T/R; Lead Free: Yes; Number Of N Channels: 1; Turn On Delay Time: 20ns; RoHS: TRUE; Digikey Description: MOSFET N-CH 60V 0.115A SOT23-3; Category: Trans; Ipc Land Pattern Name: SOT95P237X100-3; Height: 1.12mm; Device Class L2: Transistors; Drain To Source Breakdown Voltage: 60V; Device Class L1: Discrete Semiconductors; Drain To Source Voltage: 60V; Device Class L3: MOSFETs; Package: 2N7002-G
R90 = CMP-2000-03545-1: Part Number: CRCW06036K20FKEA; Manufacturer: Vishay Dale
R91 R96 R97 R106 R108 R112 R115 R120 = CMP-009-00017-5: as R54 on sheet 2_comp_stage; RoHS Compliant: True; Min Operating Temperature: -55°C; Pins: 2; Case/Package: 0603; Mounting Technology: SM; Max Operating Temperature: 155°C; Tolerance: 1%
R92 R99 R100 R105 R107 R111 R118 R119 = CMP-009-00023-5: as R50 on sheet 2_comp_stage; Max Operating Temperature: 155°C; RoHS Compliant: True; Tolerance: 1%; Pins: 2; Case/Package: 0603; Mounting Technology: SM; Min Operating Temperature: -55°C
R93 R103 = CMP-2000-03887-2: RES Thick Film, 130kΩ, 1%, 0.1W, 100ppm/°C, 0603; Resistance: 130kR; Power Rating: 100mW; Voltage Rating: 75V; Width: 0.033inch; Lead Free: Lead Free; Case Code (Imperial): 0603; Radiation Hardening: No; Termination: SMD/SMT; Tolerance: 1%; Packaging: Tape and Reel; Length: 1.55mm; Height: 0.45mm; Composition: Thick Film; Max Power Dissipation: 100mW; Max Operating Temperature: 155°C; Temperature Coefficient: 100ppm/°C; Voltage Rating (DC): 75V; Case Code (Metric): 1608; Case/Package: 0603; Military Standard: Not; Features: Automotive AEC-Q200; Number of Pins: 2; Weight: 7.1E-05oz; Min Operating Temperature: -55°C; Depth: 0.85mm; Number of Terminations: 2; Contact Plating: Tin; Package Quantity: 10
R94 R98 R109 R110 R117 = CMP-009-00063-2: Jumper 0603 (1608 Metric); Case/Package: 0603; Mounting Technology: SMT; Pins: 2
R95 R104 = CMP-2000-06934-1: Thick Film Resistor, 2.2 KOhm, 100 mW, 50 V, +/- 1%, -55 to 155 degC, 2-Pin SMD (0603), RoHS, Tape and Reel; Manufacturer: Yageo; Resistance: 2.2kOhms; Temperature Coefficient: 100PPM/C; Voltage Rating: 50V; Power Rating: 100mW; Tolerance: 1%; Datasheet Version: Rev. 7, 05/2017; Case Code - mm: 1608; Series: RC; Mounting Technology: SurfaceMount; Package Description: 2-Pin Surface Mount Device, Body 1.6 x 0.8 mm; Case Code - in: 0603; Package Reference: 0603; Product: ThickFilmResistorsGeneralPurpose; Manufacturer URL: http://www.yageo.com/; Termination Style: SMD/SMT; Operating Temperature Range: -55Cto+155C; Datasheet URL: http://www.yageo.com/documents/recent/PYu-RC_Group_51_RoHS_L_7.pdf; Packaging: Reel
R116 = CMP-009-00014-5: Chip Resistor, 1 KOhm, +/-1%, 0.1 W, -55 to 155 degC, 0603 (1608 Metric); Voltage Rating: 50V; Power: 100mW; Tolerance: 1%; Mounting Technology: SM; Pins: 2; Case/Package: 0603; Min Operating Temperature: -55°C; RoHS Compliant: True; Max Operating Temperature: 155°C
S90 S91 = 09-03290.01: Switch; Manufacturer_Name: EOZ; Manufacturer_Part_Number: 09-03290.01
U90 = CMP-1310-00430-1: as U50 on sheet 2_comp_stage; Mounting Technology: Surface Mount; PackageVersion: Rev. B, 10/2006; DatasheetVersion: Rev. 25; RoHS: TRUE; ComponentLink3URL: http://www.onsemi.com/pub_link/Collateral/948G-01.PDF; ComponentLink3Description: Package Specification; PackageDescription: 14-Pin Small Outline Package, Body 5 x 4.4 mm, Pitch 0.65 mm; PackageReference: TSSOP-14-948G-01; ComponentLink1URL: http://www.onsemi.com/; Packing: Tape and Reel; ComponentLink2Description: Datasheet; PartNumber: LM224DTBR2G; ComponentLink2URL: http://www.onsemi.cn/pub_link/Collateral/LM324-D.PDF; ComponentLink1Description: Manufacturer URL

## Sheet 1_dif_comp_stage.SchDoc
size A4; SheetNumber: 5; SheetTotal: 5
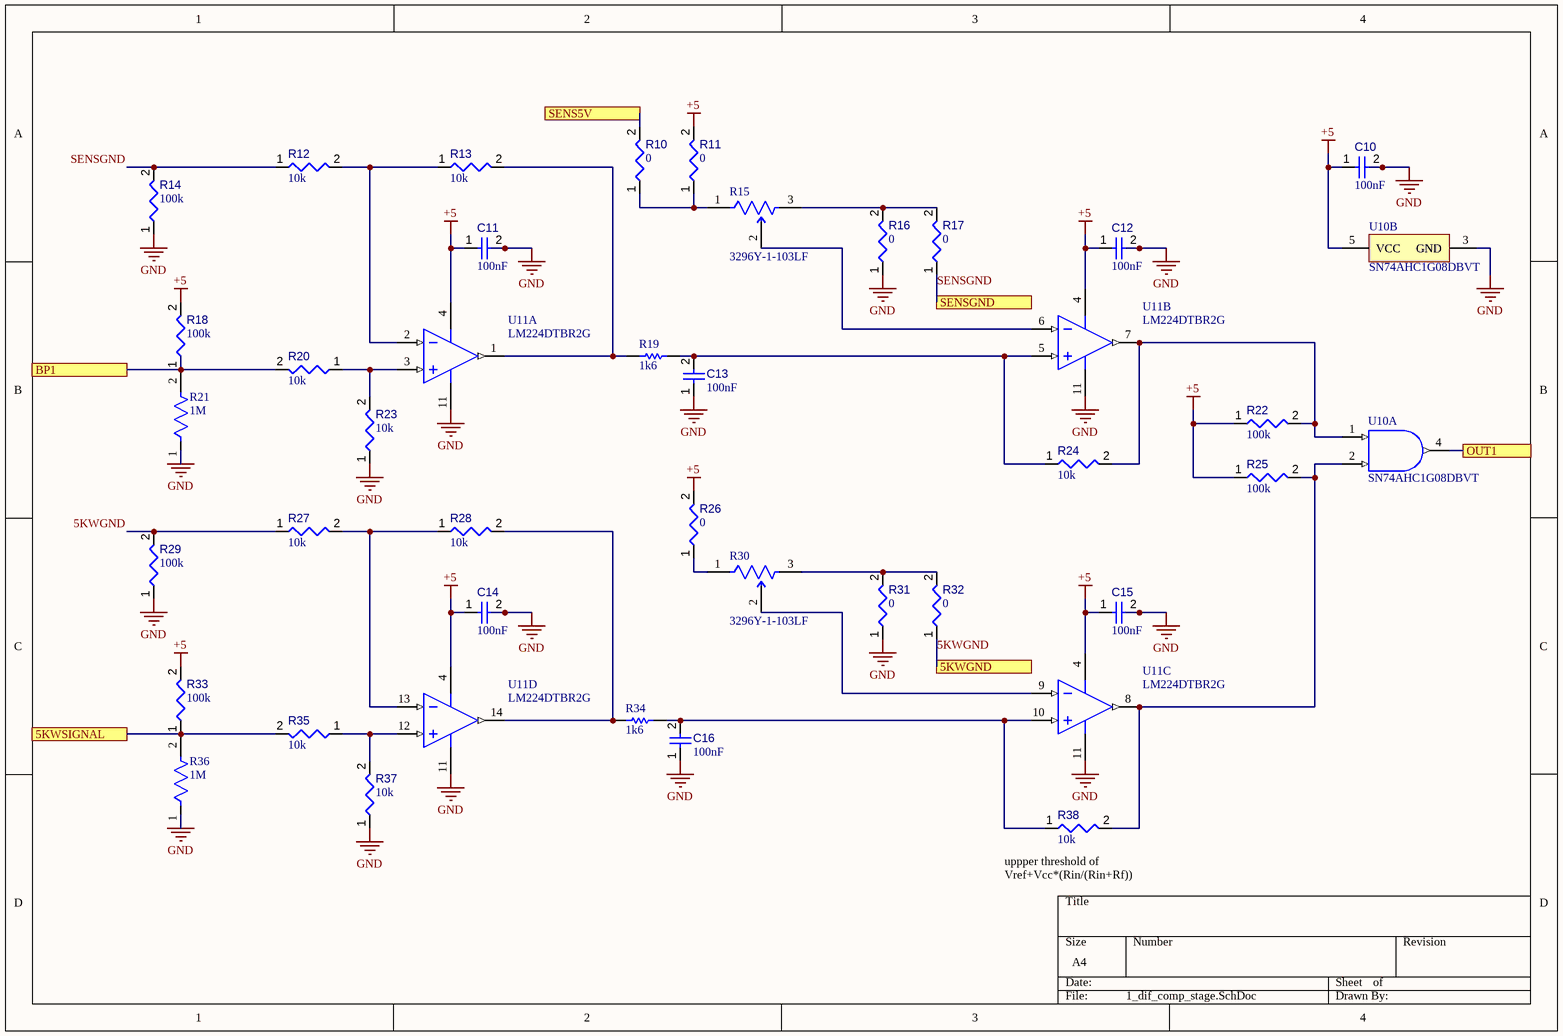
[diagram p4: 1_dif_comp_stage.SchDoc]

### Parts
C10  value 100nF  [CAPC1608X90X40NL10T20]  (hidden comment: Capacitor 100 nF +/-10% 50 V 0603)
C11  value 100nF  [CAPC1608X90X40NL10T20]  (hidden comment: Capacitor 100 nF +/-10% 50 V 0603)
C12  value 100nF  [CAPC1608X90X40NL10T20]  (hidden comment: Capacitor 100 nF +/-10% 50 V 0603)
C13  value 100nF  [CAPC1608X90X40NL10T20]  (hidden comment: Capacitor 100 nF +/-10% 50 V 0603)
C14  value 100nF  [CAPC1608X90X40NL10T20]  (hidden comment: Capacitor 100 nF +/-10% 50 V 0603)
C15  value 100nF  [CAPC1608X90X40NL10T20]  (hidden comment: Capacitor 100 nF +/-10% 50 V 0603)
C16  value 100nF  [CAPC1608X90X40NL10T20]  (hidden comment: Capacitor 100 nF +/-10% 50 V 0603)
R10  value 0  [RESC0603(1608)_L]  (hidden comment: 0R3J)
R11  value 0  [RESC0603(1608)_L]  (hidden comment: 0R3J)
R12  value 10k  [RESC1608X55X25ML10T15]  (hidden comment: Resistor 10k +/-1% 0603 100 mW)
R13  value 10k  [RESC1608X55X25ML10T15]  (hidden comment: Resistor 10k +/-1% 0603 100 mW)
R14  value 100k  [RESC1608X55X25ML10T15]  (hidden comment: Resistor 100k +/-1% 0603 100 mW)
R15  3296Y-1-103LF  [FP-3296Y-MFG]
R16  value 0  [RESC0603(1608)_L]  (hidden comment: 0R3J)
R17  value 0  [RESC0603(1608)_L]  (hidden comment: 0R3J)
R18  value 100k  [RESC1608X55X25ML10T15]  (hidden comment: Resistor 100k +/-1% 0603 100 mW)
R19  1k6  [RESC1609X50X30LL10T20]
R20  value 10k  [RESC1608X55X25ML10T15]  (hidden comment: Resistor 10k +/-1% 0603 100 mW)
R21  1M  [FP-RMCF0603-IPC_B]
R22  value 100k  [RESC1608X55X25ML10T15]  (hidden comment: Resistor 100k +/-1% 0603 100 mW)
R23  value 10k  [RESC1608X55X25ML10T15]  (hidden comment: Resistor 10k +/-1% 0603 100 mW)
R24  value 10k  [RESC1608X55X25ML10T15]  (hidden comment: Resistor 10k +/-1% 0603 100 mW)
R25  value 100k  [RESC1608X55X25ML10T15]  (hidden comment: Resistor 100k +/-1% 0603 100 mW)
R26  value 0  [RESC0603(1608)_L]  (hidden comment: 0R3J)
R27  value 10k  [RESC1608X55X25ML10T15]  (hidden comment: Resistor 10k +/-1% 0603 100 mW)
R28  value 10k  [RESC1608X55X25ML10T15]  (hidden comment: Resistor 10k +/-1% 0603 100 mW)
R29  value 100k  [RESC1608X55X25ML10T15]  (hidden comment: Resistor 100k +/-1% 0603 100 mW)
R30  3296Y-1-103LF  [FP-3296Y-MFG]
R31  value 0  [RESC0603(1608)_L]  (hidden comment: 0R3J)
R32  value 0  [RESC0603(1608)_L]  (hidden comment: 0R3J)
R33  value 100k  [RESC1608X55X25ML10T15]  (hidden comment: Resistor 100k +/-1% 0603 100 mW)
R34  1k6  [RESC1609X50X30LL10T20]
R35  value 10k  [RESC1608X55X25ML10T15]  (hidden comment: Resistor 10k +/-1% 0603 100 mW)
R36  1M  [FP-RMCF0603-IPC_B]
R37  value 10k  [RESC1608X55X25ML10T15]  (hidden comment: Resistor 10k +/-1% 0603 100 mW)
R38  value 10k  [RESC1608X55X25ML10T15]  (hidden comment: Resistor 10k +/-1% 0603 100 mW)
U10  SN74AHC1G08DBVT  [DBV0005A_L]  (parts A,B of 2)
U11  LM224DTBR2G  [ONSC-TSSOP-14-948G-01_V]  (parts A,B,C,D of 4)

### Ports
5KWGND, 5KWSIGNAL, BP1, OUT1, SENS5V, SENSGND

### Nets
+5: C10.1 C11.1 C12.1 C14.1 C15.1 R11.2 R18.2 R22.1 R25.1 R26.2 R33.2 U10.5(VCC) U11.4(VCC)
GND: C10.2 C11.2 C12.2 C13.1 C14.2 C15.2 C16.1 R14.1 R16.1 R21.1 R23.1 R29.1 R31.1 R36.1 R37.1 U10.3(GND) U11.11(VEE/GND)
5KWGND: R27.1 R29.2 R32.1 ; port 5KWGND
5KWSIGNAL: R33.1 R35.2 R36.2 ; port 5KWSIGNAL
BP1: R18.1 R20.2 R21.2 ; port BP1
SENS5V: R10.2 ; port SENS5V
SENSGND: R12.1 R14.2 R17.1 ; port SENSGND
NetC13_2: C13.2 R19.2 R24.1 U11.5(IN2+)
NetC16_2: C16.2 R34.2 R38.1 U11.10(IN3+)
NetD91_2: U10.4(Y) ; port OUT1
NetR10_1: R10.1 R11.1 R15.1(CCW)
NetR12_2: R12.2 R13.1 U11.2(IN1-)
NetR13_2: R13.2 R19.1 U11.1(OUT1)
NetR15_2: R15.2(WIPER) U11.6(IN2-)
NetR15_3: R15.3(CW) R16.2 R17.2
NetR20_1: R20.1 R23.2 U11.3(IN1+)
NetR22_2: R22.2 R24.2 U10.1(A) U11.7(OUT2)
NetR25_2: R25.2 R38.2 U10.2(B) U11.8(OUT3)
NetR26_1: R26.1 R30.1(CCW)
NetR27_2: R27.2 R28.1 U11.13(IN4-)
NetR28_2: R28.2 R34.1 U11.14(OUT4)
NetR30_2: R30.2(WIPER) U11.9(IN3-)
NetR30_3: R30.3(CW) R31.2 R32.2
NetR35_1: R35.1 R37.2 U11.12(IN4+)

### Notes on the sheet
- (near R38) uppper threshold of Vref+Vcc*(Rin/(Rin+Rf))

### Library data of the parts
C10-C16 = CMP-001-00017-6: as C50 on sheet 2_comp_stage; Tolerance: 10%; Mounting Technology: SM; Max Operating Temperature: 125°C; RoHS Compliant: True; Pins: 2; Case/Package: 0603; Min Operating Temperature: -55°C
R10 R11 R16 R17 R26 R31 R32 = CMP-009-00063-2: Jumper 0603 (1608 Metric); Case/Package: 0603; Mounting Technology: SMT; Pins: 2
R12 R13 R20 R23 R24 R27 R28 R35 R37 R38 = CMP-009-00017-5: as R54 on sheet 2_comp_stage; RoHS Compliant: True; Min Operating Temperature: -55°C; Pins: 2; Case/Package: 0603; Mounting Technology: SM; Max Operating Temperature: 155°C; Tolerance: 1%
R14 R18 R22 R25 R29 R33 = CMP-009-00023-5: as R50 on sheet 2_comp_stage; Max Operating Temperature: 155°C; RoHS Compliant: True; Tolerance: 1%; Pins: 2; Case/Package: 0603; Mounting Technology: SM; Min Operating Temperature: -55°C
R15 R30 = CMP-07234-000015-2: as R63 on sheet 2_comp_stage; Military Standard: Not; REACH SVHC: No SVHC; Lead Free: Lead Free; Resistor Type: Cermet; Max Operating Temperature: 125°C; Radiation Hardening: No; Package Quantity: 50; Mount: Panel; Max Power Dissipation: 500mW; Min Operating Temperature: -55°C; Type: Potentiometer; Terminal Finish: Tin; Termination: Pin; Taper: Linear; Color: Blue; Technology: CERMET; Packaging: Rail/Tube; Weight: 0.03oz; Height: 0.395inch; Number of Pins: 3; RoHS Compliant: Yes; Width: 9.53mm; Tolerance: 10%; Depth: 4.83mm; Series: 3296; Length: 9.53mm
R19 R34 = CMP-2000-03000-1: as R51 on sheet 2_comp_stage
R21 R36 = CMP-26527-006958-1: as R52 on sheet 2_comp_stage; Series: RMCF; Case/Package: 0603; Packaging: Tape and Reel; Technology: THICK FILM; Depth: 0.8mm; Contact Plating: Tin; Lead Free: Lead Free; Mount: Surface Mount; Features: Automotive AEC-Q200; Construction: Rectangular; Length: 1.55mm; Tolerance: 1%; Resistor Type: Thick Film; Max Power Dissipation: 100mW; Case Code (Imperial): 0603; Height: 0.022inch; Max Operating Temperature: 155°C; Radiation Hardening: No; Width: 0.031inch; Min Operating Temperature: -55°C; Military Standard: Not; Number of Terminations: 2; Case Code (Metric): 1608; RoHS Compliant: Yes
U10 = CMP-0859-00047-3: Single 2-Input Positive-AND Gate, DBV0005A, SMALL T&R; Manufacturer: Texas Instruments; ICC @ Nom Voltage(Max)(mA): 0.01; Rating: Catalog; Output Drive (IOL/IOH)(Max)(mA): 50/-50; F @ Nom Voltage(Max)(Mhz): 75; Technology Family: AHC; VCC(Max)(V): 5.5; Voltage(Nom)(V): 3.3,5; Logic: True; Input Type: CMOS; tpd @ Nom Voltage(Max)(ns): 12.3,7.9; Bits(#): 1; Gate Type: AND; Schmitt Trigger: No; VCC(Min)(V): 2; Operating Temperature Range(C): -55 to 125; Sub-Family: AND Gate; Generic Part Number: SN74AHC1G08; PackageReference: DBV0005A; DatasheetVersion: SCLS314N; Output Type: CMOS; 3-State Output: No
U11 = CMP-1310-00430-1: as U50 on sheet 2_comp_stage; Mounting Technology: Surface Mount; PackageVersion: Rev. B, 10/2006; DatasheetVersion: Rev. 25; RoHS: TRUE; ComponentLink3URL: http://www.onsemi.com/pub_link/Collateral/948G-01.PDF; ComponentLink3Description: Package Specification; PackageDescription: 14-Pin Small Outline Package, Body 5 x 4.4 mm, Pitch 0.65 mm; PackageReference: TSSOP-14-948G-01; ComponentLink1URL: http://www.onsemi.com/; Packing: Tape and Reel; ComponentLink2Description: Datasheet; PartNumber: LM224DTBR2G; ComponentLink2URL: http://www.onsemi.cn/pub_link/Collateral/LM324-D.PDF; ComponentLink1Description: Manufacturer URL

## Nets that join several sheets
+5: 2_comp_stage (12 pins), Power_stage (C103.2 U102.2), Delay_latch_stage (17 pins), 1_dif_comp_stage (13 pins)
+12: Power_stage (9 pins), Delay_latch_stage (5 pins)
GND: 2_comp_stage (12 pins), Power_stage (19 pins), Delay_latch_stage (26 pins), 1_dif_comp_stage (17 pins)
1FAULT: Power_stage (Q101.1 Q102.1 Q103.1), Delay_latch_stage (5 pins)
1RST-: Power_stage (J100.15), Delay_latch_stage (5 pins)
2FAULT: Power_stage (Q104.1 Q105.1 Q106.1), Delay_latch_stage (5 pins)
2RST-: Power_stage (J100.1), Delay_latch_stage (5 pins)
5KWGND: Power_stage (J101.4), 1_dif_comp_stage (R27.1 R29.2 R32.1)
5KWSIGNAL: Power_stage (J101.10), 1_dif_comp_stage (R33.1 R35.2 R36.2)
BP1: Power_stage (J101.8 J101.9), 1_dif_comp_stage (R18.1 R20.2 R21.2)
NetD91_2: Delay_latch_stage (D91.2 R95.2), 1_dif_comp_stage (U10.4)
NetD93_2: 2_comp_stage (IC50.4), Delay_latch_stage (D93.2 R104.2)
NetR112_2: Power_stage (R128.1), Delay_latch_stage (R112.2 R118.2 U90.14)
SENS5V: Power_stage (J101.2), 1_dif_comp_stage (R10.2)
SENSGND: Power_stage (J101.3), 1_dif_comp_stage (R12.1 R14.2 R17.1)
THERM1_5V: 2_comp_stage (R61.2), Power_stage (J100.8)
THERM1_GND: 2_comp_stage (R65.1), Power_stage (J100.6)
THERM1_SIG: 2_comp_stage (R50.1 R52.2 U50.3), Power_stage (J100.5)
THERM2_5V: 2_comp_stage (R62.2), Power_stage (J100.4)
THERM2_GND: 2_comp_stage (R66.1), Power_stage (J100.2)
THERM2_SIG: 2_comp_stage (R56.1 R58.2 U50.12), Power_stage (J100.3)